# EAGLE design orbB (EAGLE 5.11)
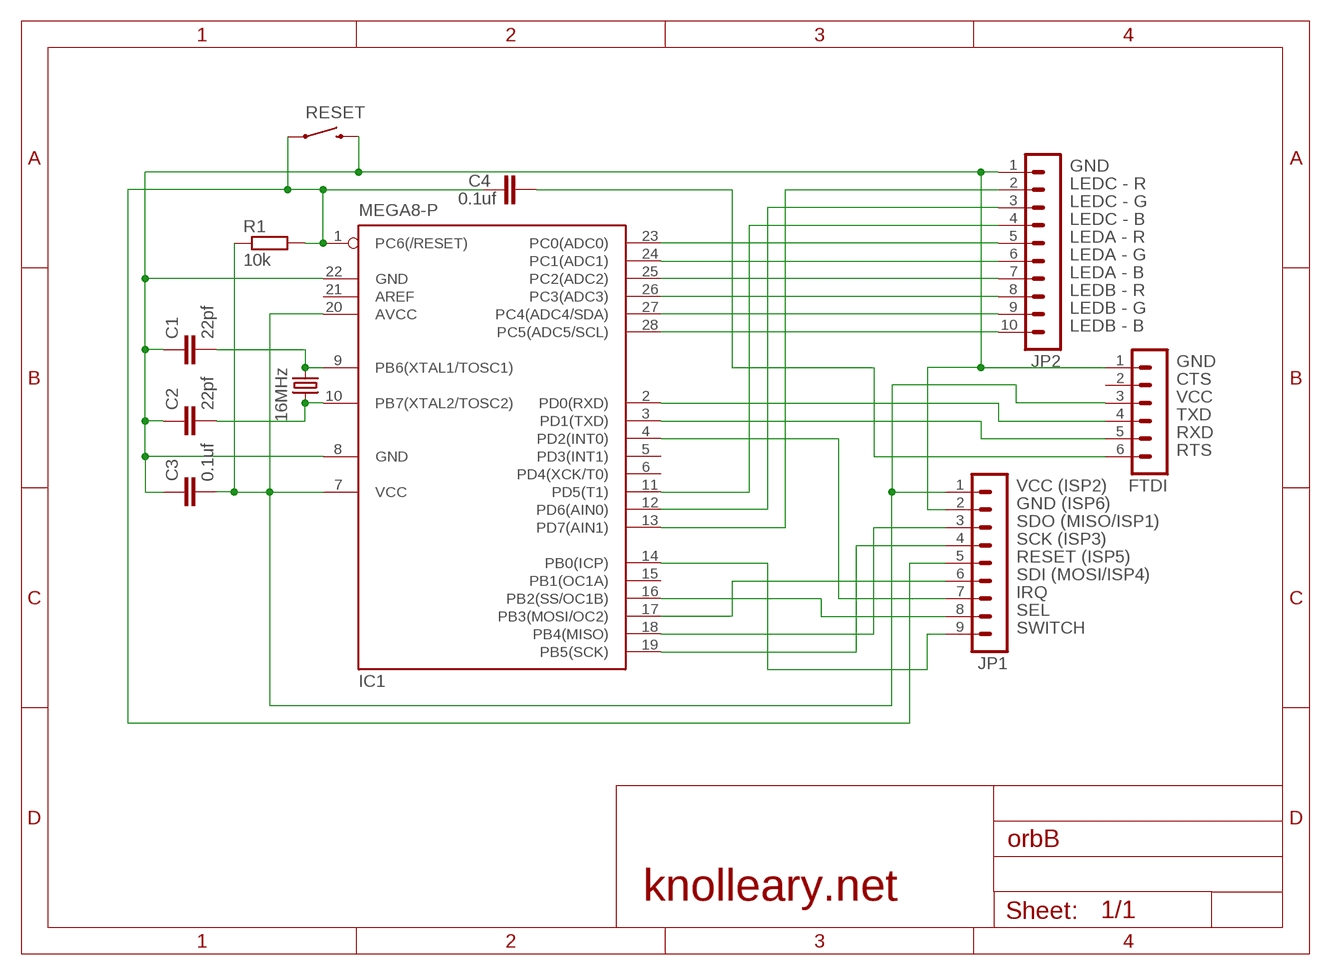
[diagram p0: schematic, sheet 1]

## Parts
C1  22pf  C-EU025-025X050  [C025-025X050]
C2  22pf  C-EU025-025X050  [C025-025X050]
C3  0.1uf  C-EU025-025X050  [C025-025X050]
C4  0.1uf  C-EU025-025X050  [C025-025X050]
FTDI  MA06-1  [MA06-1]
IC1  MEGA8-P  [DIL28-3]
JP1  MA09-1  [MA09-1]
JP2  MA10-1  [MA10-1]
Q1  16MHz  CRYSTALHC49S  [HC49/S]
R1  10k  R-EU_0204/7  [0204/7]
RESET  SWITCH-MOMENTARY-2-SMD-1101NE  [TACTILE-SWITCH-1101NE]

## Nets
GND: C1.1 C2.1 C3.1 FTDI.1 IC1.8(GND) IC1.22(GND) JP1.2 JP2.1 RESET.P$2
N$1: IC1.16(PB2(SS/OC1B)) JP1.8
N$2: IC1.4(PD2(INT0)) JP1.7
N$3: IC1.23(PC0(ADC0)) JP2.5
N$4: C1.2 IC1.9(PB6(XTAL1/TOSC1)) Q1.1
N$5: C2.2 IC1.10(PB7(XTAL2/TOSC2)) Q1.2
N$6: C4.1 IC1.1(PC6(/RESET)) JP1.5 R1.2 RESET.P$1
N$8: IC1.24(PC1(ADC1)) JP2.6
N$9: IC1.25(PC2(ADC2)) JP2.7
N$10: IC1.26(PC3(ADC3)) JP2.8
N$11: IC1.27(PC4(ADC4/SDA)) JP2.9
N$12: IC1.28(PC5(ADC5/SCL)) JP2.10
N$13: IC1.11(PD5(T1)) JP2.4
N$14: IC1.14(PB0(ICP)) JP1.9
N$15: IC1.18(PB4(MISO)) JP1.3
N$16: IC1.19(PB5(SCK)) JP1.4
N$17: IC1.12(PD6(AIN0)) JP2.3
N$18: IC1.17(PB3(MOSI/OC2)) JP1.6
N$19: IC1.13(PD7(AIN1)) JP2.2
N$21: C4.2 FTDI.6
N$23: FTDI.4 IC1.2(PD0(RXD))
N$24: FTDI.5 IC1.3(PD1(TXD))
VCC: C3.2 FTDI.3 IC1.7(VCC) IC1.20(AVCC) JP1.1 R1.1
Unconnected: FTDI.2 IC1.5(PD3(INT1)) IC1.6(PD4(XCK/T0)) IC1.15(PB1(OC1A)) IC1.21(AREF)

## Notes on the sheet
- GND
- LEDC - R
- LEDC - G
- LEDC - B
- LEDA - R
- LEDA - G
- LEDA - B
- LEDB - R
- LEDB - G
- LEDB - B
- GND
- CTS
- VCC
- TXD
- RXD
- RTS
- VCC (ISP2)
- GND (ISP6)
- SDO (MISO/ISP1)
- SCK (ISP3)
- RESET (ISP5)
- SDI (MOSI/ISP4)
- IRQ
- SEL
- SWITCH

## Library data of the parts
C1-C4 = rcl:C-EU: CAPACITOR, European symbol
FTDI = con-lstb:MA06-1: PIN HEADER; OC_FARNELL: unknown; OC_NEWARK: unknown
IC1 = atmel:MEGA8-P: MICROCONTROLLER 8 Kbytes FLASH, 1 kbytes SRAM, 512 bytes EEPROM, USART, 4-channel 10 bit ADC, 2-channel 8 bit ADC Pin compatible with Atmega48, ATMega88, ATMega168 Source: avr.lbr; OC_FARNELL: unknown; OC_NEWARK: unknown
JP1 = con-lstb:MA09-1: PIN HEADER; OC_FARNELL: unknown; OC_NEWARK: unknown
JP2 = con-lstb:MA10-1: PIN HEADER; OC_FARNELL: unknown; OC_NEWARK: unknown
Q1 = crystal:CRYSTAL: CRYSTAL; OC_FARNELL: 1667008; OC_NEWARK: unknown
R1 = resistor:R-EU_: RESISTOR, European symbol
RESET = SparkFun:SWITCH-MOMENTARY-2

## Board
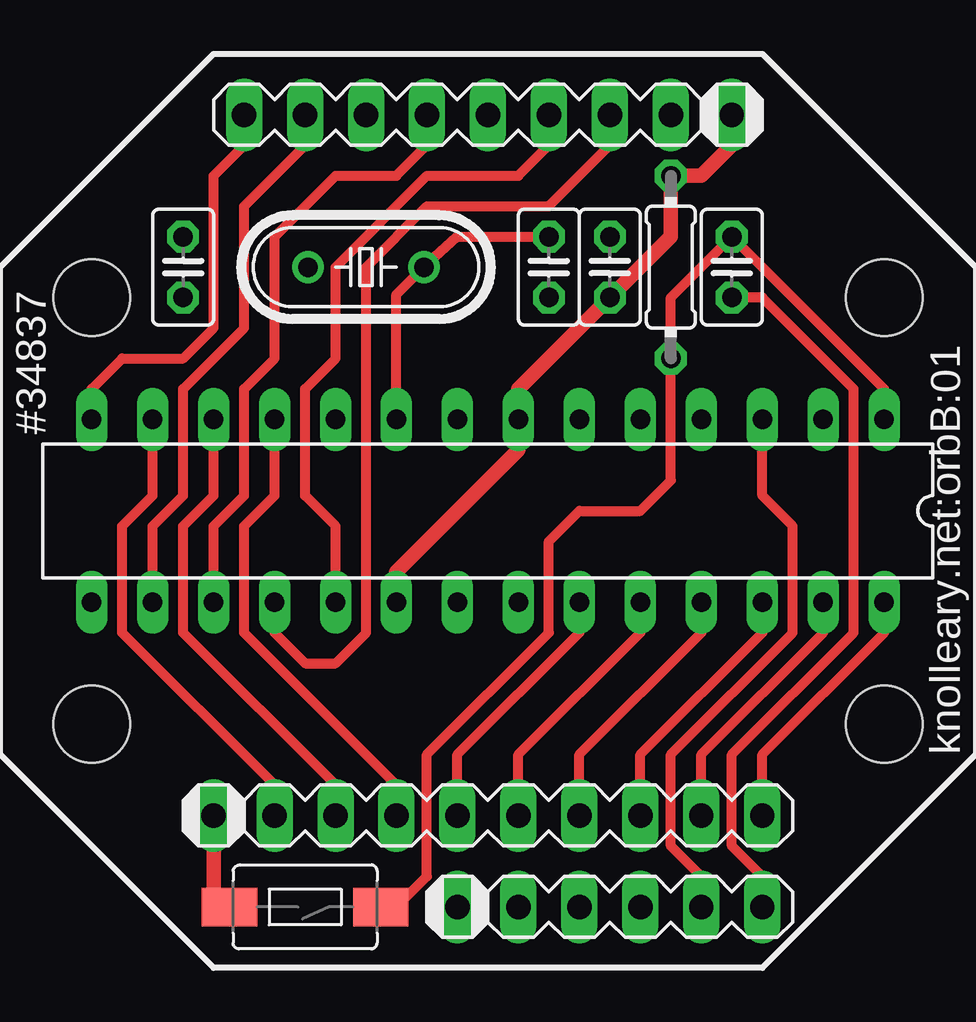
[diagram p1: board, top side]
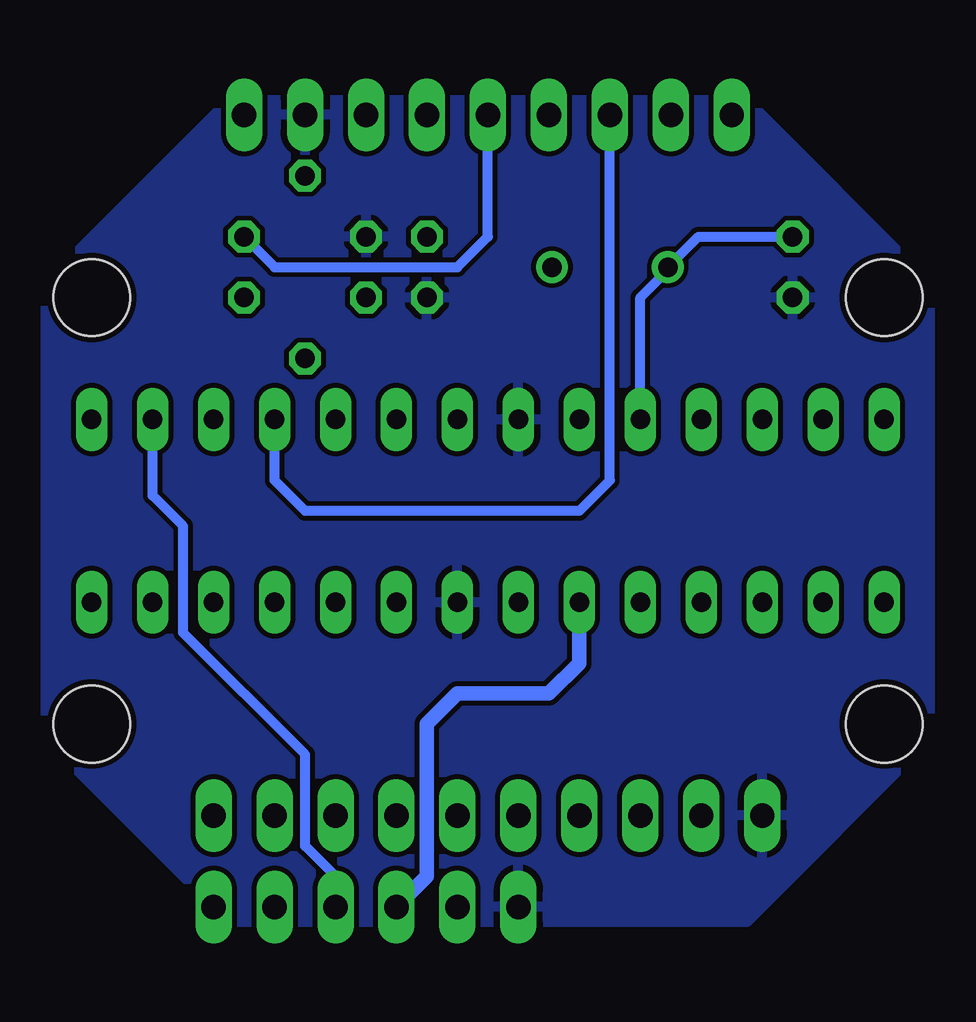
[diagram p2: board, bottom side, seen from below]

No outline drawn. Coordinates in mm, seen from the top.
Copper layers (1*16): Top 0.035mm / dielectric 1.5mm / Bottom 0.035mm
Design rules "Fusion_eagle_rule_v1.1 *": minimum track width 6mil, minimum drill 12mil, track to track 8mil, track to pad 8mil, pad to pad 8mil, via to via 8mil, smd to smd 0mil, copper to edge 10mil, drill to drill 10mil, minimum pad ring 10mil, minimum via ring 6mil, stop-mask expansion 2mil, vias tented up to drill 100mil, thermal gap 10mil
Holes 3.2 mm at 3.81,27.94 36.83,27.94 3.81,10.16 36.83,10.16

### Footprints (pad centres in the part's own frame; a part is rotated, then mirrored left to right if it is on the bottom)
C025-025X050 = drill 0.813 octagon: 1 -1.27,0; 2 1.27,0
MA06-1 = drill 1.016 long: 1 -6.35,0; 2 -3.81,0; 3 -1.27,0; 4 1.27,0; 5 3.81,0; 6 6.35,0
DIL28-3 = drill 0.813 long: 1 -16.51,-3.81; 2 -13.97,-3.81; 3 -11.43,-3.81; 4 -8.89,-3.81; 5 -6.35,-3.81; 6 -3.81,-3.81; 7 -1.27,-3.81; 8 1.27,-3.81; 9 3.81,-3.81; 10 6.35,-3.81; 11 8.89,-3.81; 12 11.43,-3.81; 13 13.97,-3.81; 14 16.51,-3.81; 15 16.51,3.81; 16 13.97,3.81; 17 11.43,3.81; 18 8.89,3.81; 19 6.35,3.81; 20 3.81,3.81; 21 1.27,3.81; 22 -1.27,3.81; 23 -3.81,3.81; 24 -6.35,3.81; 25 -8.89,3.81; 26 -11.43,3.81; 27 -13.97,3.81; 28 -16.51,3.81
MA09-1 = drill 1.016 long: 1 -10.16,0; 2 -7.62,0; 3 -5.08,0; 4 -2.54,0; 5 0,0; 6 2.54,0; 7 5.08,0; 8 7.62,0; 9 10.16,0
MA10-1 = drill 1.016 long: 1 -11.43,0; 2 -8.89,0; 3 -6.35,0; 4 -3.81,0; 5 -1.27,0; 6 1.27,0; 7 3.81,0; 8 6.35,0; 9 8.89,0; 10 11.43,0
HC49/S = drill 0.813 round: 1 -2.413,0; 2 2.413,0
0204/7 = drill 0.813 octagon: 1 -3.81,0; 2 3.81,0
TACTILE-SWITCH-1101NE = smd 2.3 x 1.6: P$1 -3.15,0; P$2 3.15,0

### Placement (x,y rotation side)
C1  22.86,29.21 90 top
C2  7.62,29.21 90 top
C3  25.4,29.21 270 top
C4  30.48,29.21 270 top
FTDI  25.4,2.54 0 top
IC1  20.32,19.05 180 top
JP1  20.32,35.56 180 top
JP2  20.32,6.35 0 top
Q1  15.24,29.21 180 top
R1  27.94,29.21 270 top
RESET  12.7,2.54 180 top

### Tracks (layer width: path | path; a pad name or v marks a point on that pad's centre or on a via)
GND
  Top 0.61: JP2.1 8.89,2.54 RESET.P$2
  pour Bottom: 1.91,28.57 1.91,9.53 9.53,1.91 31.11,1.91 38.73,9.53 38.73,28.57 31.11,36.2 9.53,36.2
N$1
  Top 0.406: JP1.8 12.7,34.29 10.16,31.75 10.16,26.67 7.62,24.13 7.62,19.68 6.35,18.41 IC1.16
N$2
  Bottom 0.406: JP1.7 15.24,20.32 16.51,19.05 27.94,19.05 29.21,20.32 IC1.4
N$3
  Top 0.406: JP2.5 19.05,8.89 24.13,13.97 IC1.23
N$4
  Top 0.406: IC1.9 16.51,28.07 Q1.1 19.05,30.48 C1.2
N$5
  Bottom 0.406: C2.2 11.56,30.48 Q1.2 12.83,29.08 13.97,27.94 IC1.10
N$6
  Top 0.406: RESET.P$1 16.51,2.54 17.78,3.81 17.78,8.89 22.86,13.97 22.86,17.78 24.13,19.05 26.67,19.05 27.94,20.32 R1.2 27.94,27.94 C4.1 36.83,24.13 IC1.1
  Bottom 0.406: JP1.5 20.32,30.48 21.59,29.21 29.21,29.21 C4.1
N$8
  Top 0.406: JP2.6 21.59,8.89 26.67,13.97 IC1.24
N$9
  Top 0.406: JP2.7 24.13,8.89 29.21,13.97 IC1.25
N$10
  Top 0.406: JP2.8 26.67,8.89 31.75,13.97 IC1.26
N$11
  Top 0.406: JP2.9 29.21,8.89 34.29,13.97 IC1.27
N$12
  Top 0.406: JP2.10 31.75,8.89 36.83,13.97 IC1.28
N$13
  Top 0.406: IC1.11 11.43,19.68 10.16,18.41 10.16,13.97 16.51,7.62 JP2.4
N$14
  Top 0.406: JP1.9 10.16,34.29 8.89,33.02 8.89,26.67 7.62,25.4 5.08,25.4 3.81,24.13 IC1.14
N$15
  Top 0.406: JP1.3 25.4,34.29 22.86,31.75 17.78,31.75 15.24,29.21 15.24,13.97 13.97,12.7 12.7,12.7 11.43,13.97 IC1.18
N$16
  Top 0.406: IC1.19 13.97,18.41 12.7,19.68 12.7,24.13 13.97,25.4 13.97,29.21 17.78,33.02 21.59,33.02 22.86,34.29 JP1.4
N$17
  Top 0.406: IC1.12 8.89,19.68 7.62,18.41 7.62,13.97 13.97,7.62 JP2.3
N$18
  Top 0.406: IC1.17 8.89,18.41 10.16,19.68 10.16,24.13 11.43,25.4 11.43,30.48 13.97,33.02 16.51,33.02 17.78,34.29 JP1.6
N$19
  Top 0.406: IC1.13 6.35,19.68 5.08,18.41 5.08,13.97 11.43,7.62 JP2.2
N$21
  Top 0.406: FTDI.6 31.75,3.81 30.48,5.08 30.48,8.89 35.56,13.97 35.56,24.13 34.29,25.4 31.75,27.94 C4.2
N$23
  Bottom 0.406: FTDI.4 26.67,3.81 27.94,5.08 27.94,8.89 33.02,13.97 33.02,18.41 34.29,19.68 IC1.2
N$24
  Top 0.406: IC1.3 31.75,19.68 33.02,18.41 33.02,13.97 27.94,8.89 27.94,5.08 29.21,3.81 FTDI.5
VCC
  Top 0.61: IC1.20 16.51,16.51 21.59,21.59 IC1.7 21.59,24.13 C3.2 27.94,30.48 R1.1 29.21,33.02 30.48,34.29 JP1.1
  Bottom 0.61: IC1.20 16.51,12.7 17.78,11.43 21.59,11.43 22.86,10.16 22.86,3.81 FTDI.3

### Text on the board
tPlace: #34837 | knolleary.net:orbB:01